# EAGLE schematic mcu (EAGLE 9.3.2)
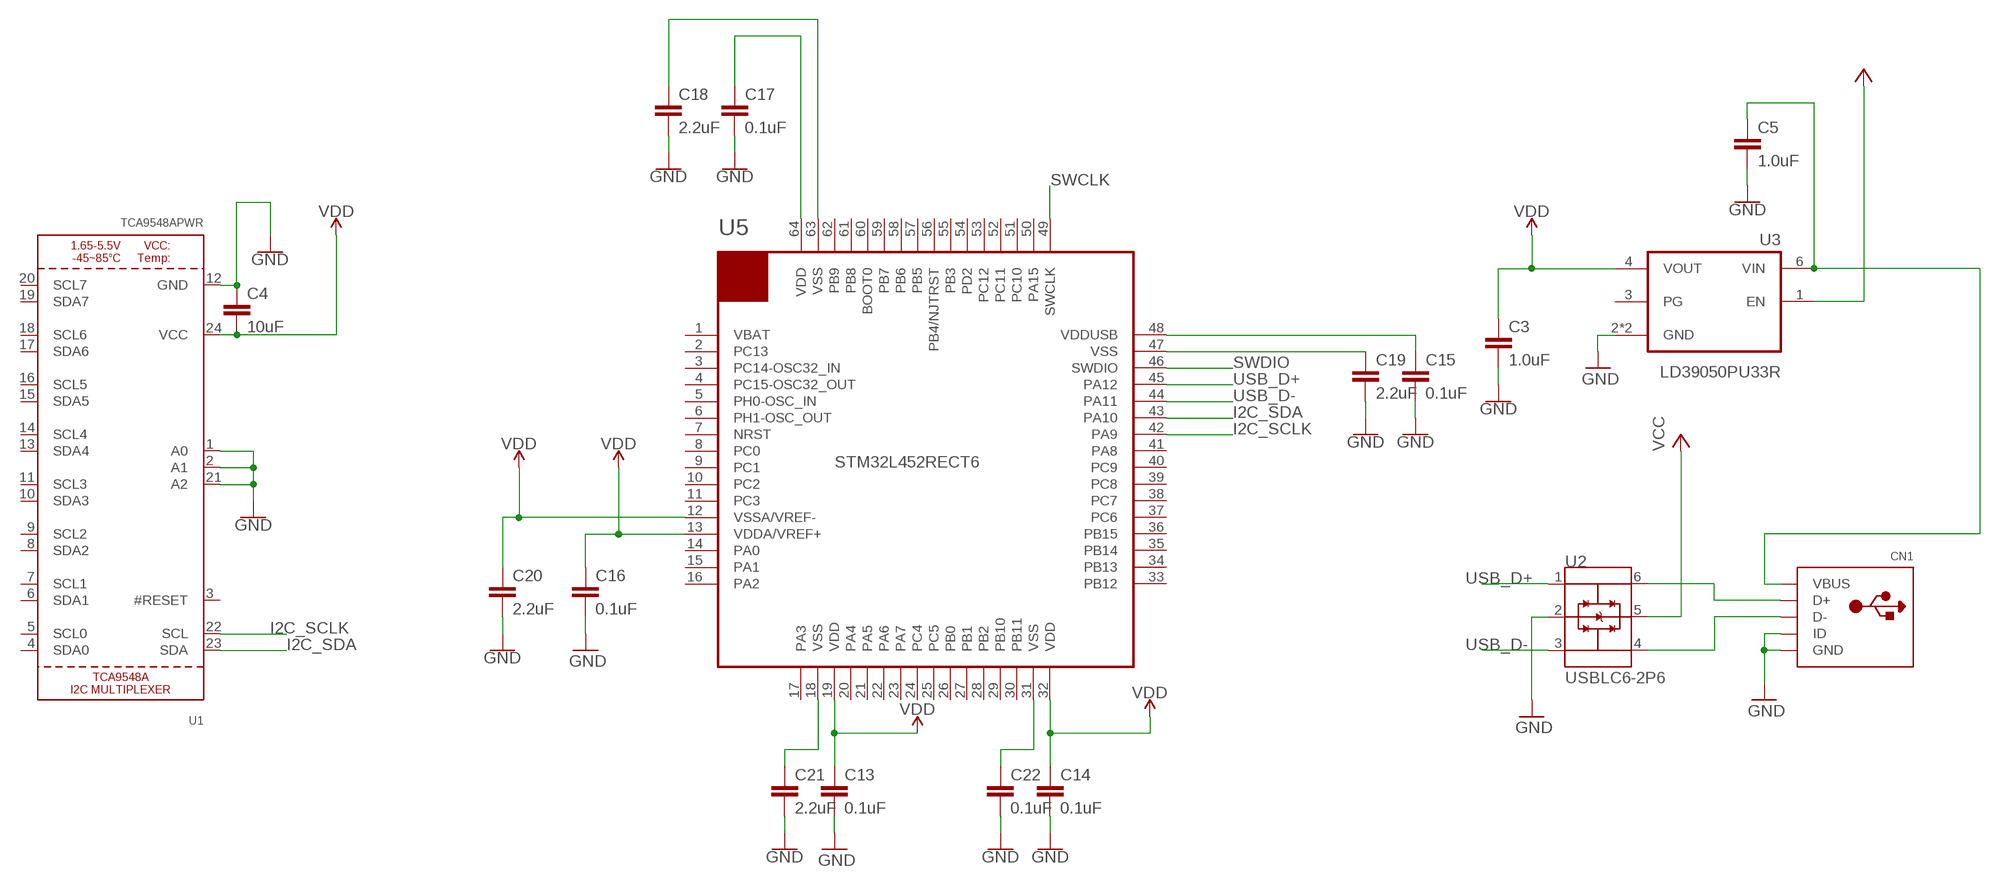
[diagram p0: schematic, sheet 1]

## Parts
C3  1.0uF  1.0UF-0402-16V-10%  [0402]
C4  10uF  10UF-0603-6.3V-20%  [0603]
C5  1.0uF  1.0UF-0402-16V-10%  [0402]
C13  0.1uF  .1UF-CER  [0402-CAP]
C14  0.1uF  .1UF-CER  [0402-CAP]
C15  0.1uF  .1UF-CER  [0402-CAP]
C16  0.1uF  .1UF-CER  [0402-CAP]
C17  0.1uF  .1UF-CER  [0402-CAP]
C18  2.2uF  2.2UF-0402_TIGHT-10V-10%-X5R  [0402-TIGHT]
C19  2.2uF  2.2UF-0402_TIGHT-10V-10%-X5R  [0402-TIGHT]
C20  2.2uF  2.2UF-0402_TIGHT-10V-10%-X5R  [0402-TIGHT]
C21  2.2uF  2.2UF-0402_TIGHT-10V-10%-X5R  [0402-TIGHT]
C22  0.1uF  .1UF-CER  [0402-CAP]
CN1  USBMINIB  [USB-MINIB]
U1  TCA9548APWR  TCA9548A  [TSSOP24]
U2  USBLC6-2P6  [SOT50P160X60-6N]
U3  LD39050PU33R  [SON95P300X300X100-7N]
U5  STM32L452RECT6  [LQFP-64]

## Nets
GND: C3.2 C4.1 C5.2 C13.2 C14.2 C15.2 C16.2 C17.2 C18.2 C19.2 C20.2 C21.2 C22.2 CN1.GND CN1.ID U1.1(A0) U1.2(A1) U1.12(GND) U1.21(A2) U2.2(GND) U3.2(GND) U3.7(GND)
I2C_SCLK: U1.22(SCL) U5.42(PA9)
I2C_SDA: U1.23(SDA) U5.43(PA10)
N$1: CN1.D+ U2.6(I/O1_2)
N$2: CN1.D- U2.4(I/O2_2)
N$3: C5.1 CN1.VBUS U3.6(VIN)
N$21: C15.1 U5.48(VDDUSB)
N$22: C19.1 U5.47(VSS)
N$26: C21.1 U5.18(VSS)
N$29: C17.1 U5.64(VDD)
N$30: C18.1 U5.63(VSS)
N$31: C22.1 U5.31(VSS)
SWCLK: U5.49(SWCLK)
SWDIO: U5.46(SWDIO)
USB_D+: U2.1(I/O1_1) U5.45(PA12)
USB_D-: U2.3(I/O2_1) U5.44(PA11)
VCC: U2.5(VBUS) U3.1(EN)
VDD: C3.1 C4.2 C13.1 C14.1 C16.1 C20.1 U1.24(VCC) U3.4(VOUT) U5.12(VSSA/VREF-) U5.13(VDDA/VREF+) U5.19(VDD) U5.32(VDD)
Unconnected: U1.3(#RESET) U1.4(SDA0) U1.5(SCL0) U1.6(SDA1) U1.7(SCL1) U1.8(SDA2) U1.9(SCL2) U1.10(SDA3) U1.11(SCL3) U1.13(SDA4) U1.14(SCL4) U1.15(SDA5) U1.16(SCL5) U1.17(SDA6) U1.18(SCL6) U1.19(SDA7) U1.20(SCL7) U3.3(PG) U5.2(PC13) U5.3(PC14-OSC32_IN) U5.4(PC15-OSC32_OUT) U5.5(PH0-OSC_IN) U5.6(PH1-OSC_OUT) U5.7(NRST) U5.8(PC0) U5.9(PC1) U5.10(PC2) U5.11(PC3) U5.14(PA0) U5.15(PA1) U5.16(PA2) U5.17(PA3) U5.20(PA4) U5.21(PA5) U5.22(PA6) U5.23(PA7) U5.24(PC4) U5.25(PC5) U5.26(PB0) U5.27(PB1) U5.28(PB2) U5.29(PB10) U5.30(PB11) U5.33(PB12) U5.34(PB13) U5.35(PB14) U5.36(PB15) U5.37(PC6) U5.38(PC7) U5.39(PC8) U5.40(PC9) U5.41(PA8) U5.50(PA15) U5.51(PC10) U5.52(PC11) U5.53(PC12) U5.54(PD2) U5.55(PB3) U5.56(PB4/NJTRST) U5.57(PB5) U5.58(PB6) U5.59(PB7) U5.60(BOOT0) U5.61(PB8) U5.62(PB9)

## Power pins joined to a net without a drawn wire
VBAT: U5.1(VBAT)

## Library data of the parts
C3 C5 = SparkFun-Capacitors:1.0UF: 1µF ceramic capacitors A capacitor is a passive two-terminal electrical component used to store electrical energy temporarily in an electric field.; PROD_ID: CAP-12417
C4 = SparkFun-Capacitors:10UF: 10.0µF ceramic capacitors A capacitor is a passive two-terminal electrical component used to store electrical energy temporarily in an electric field.; PROD_ID: CAP-11015
C13-C17 C22 = SparkFun-Retired:.1UF-CER: .1uF ceramic SMT CAP-00810- 25V +80%/-20% (0603) CAP-08390- 100V 10% (0603) CAP-08604- 25V 5% (0603); PROD_ID: CAP-00810
C18-C21 = SparkFun-Capacitors:2.2UF: 2.2µF ceramic capacitors A capacitor is a passive two-terminal electrical component used to store electrical energy temporarily in an electric field.; PROD_ID: CAP-14232
CN1 = adafruit:USB: USB Connectors USBMINIB - Surface Mount Female Mini-B USB Connector 4UConnector: 06564 By microbuilder.eu Thru-hole RA Female Mini-B USB Connector 4UConnector: 18732 By ladyada.net
U1 = microbuilder:TCA9548A: TCA9548A I2C Multiplexer
U2 = USBLC6-2P6:USBLC6-2P6: The USBLC6-2SC6 and USBLC6-2P6 are monolithic application specific devices dedicated to ESD protection of high speed interfaces, such as USB 2.0, Ethernet links and video lines. The very low line capacitance secures a high level of signal integrity without compromising in protecting sensitive chips against the most stringently characterized ESD strikes; AVAILABILITY: Unavailable; DESCRIPTION: USBLC6 Series 2 Line 6 V SMT Bi Directional ESD Protection - SOT-666; MF: STMicroelectronics; MP: USBLC6-2P6; PACKAGE: SOT-563 STMicroelectronics; PRICE: None
U3 = LD39050PU33R:LD39050PU33R: LD39050 Series 500 mA 3.3 V Fixed Low Noise LDO Voltage Regulator - DFN-6; AVAILABILITY: Unavailable; DESCRIPTION: LD39050 Series 500 mA 3.3 V Fixed Low Noise LDO Voltage Regulator - DFN-6; MF: STMicroelectronics; MP: LD39050PU33R; PACKAGE: DFN-6 STMicroelectronics; PRICE: None
U5 = STM32:STM32L452RE: STM32L476RXX - Ultra-low-power ARM ® Cortex ® -M4 32-bit MCU+FPU, 100DMIPS, up to 1MB Flash, 128 KB SRAM, USB OTG FS, LCD, analog, audio Datasheet <http://www.st.com/st-web-ui/static/active/en/resource/technical/document/datasheet/DM00108832.pdf>; FLASH: 256KB; MFPN: STM32L476RCT6